# EAGLE design ignition3 (EAGLE 6.4)
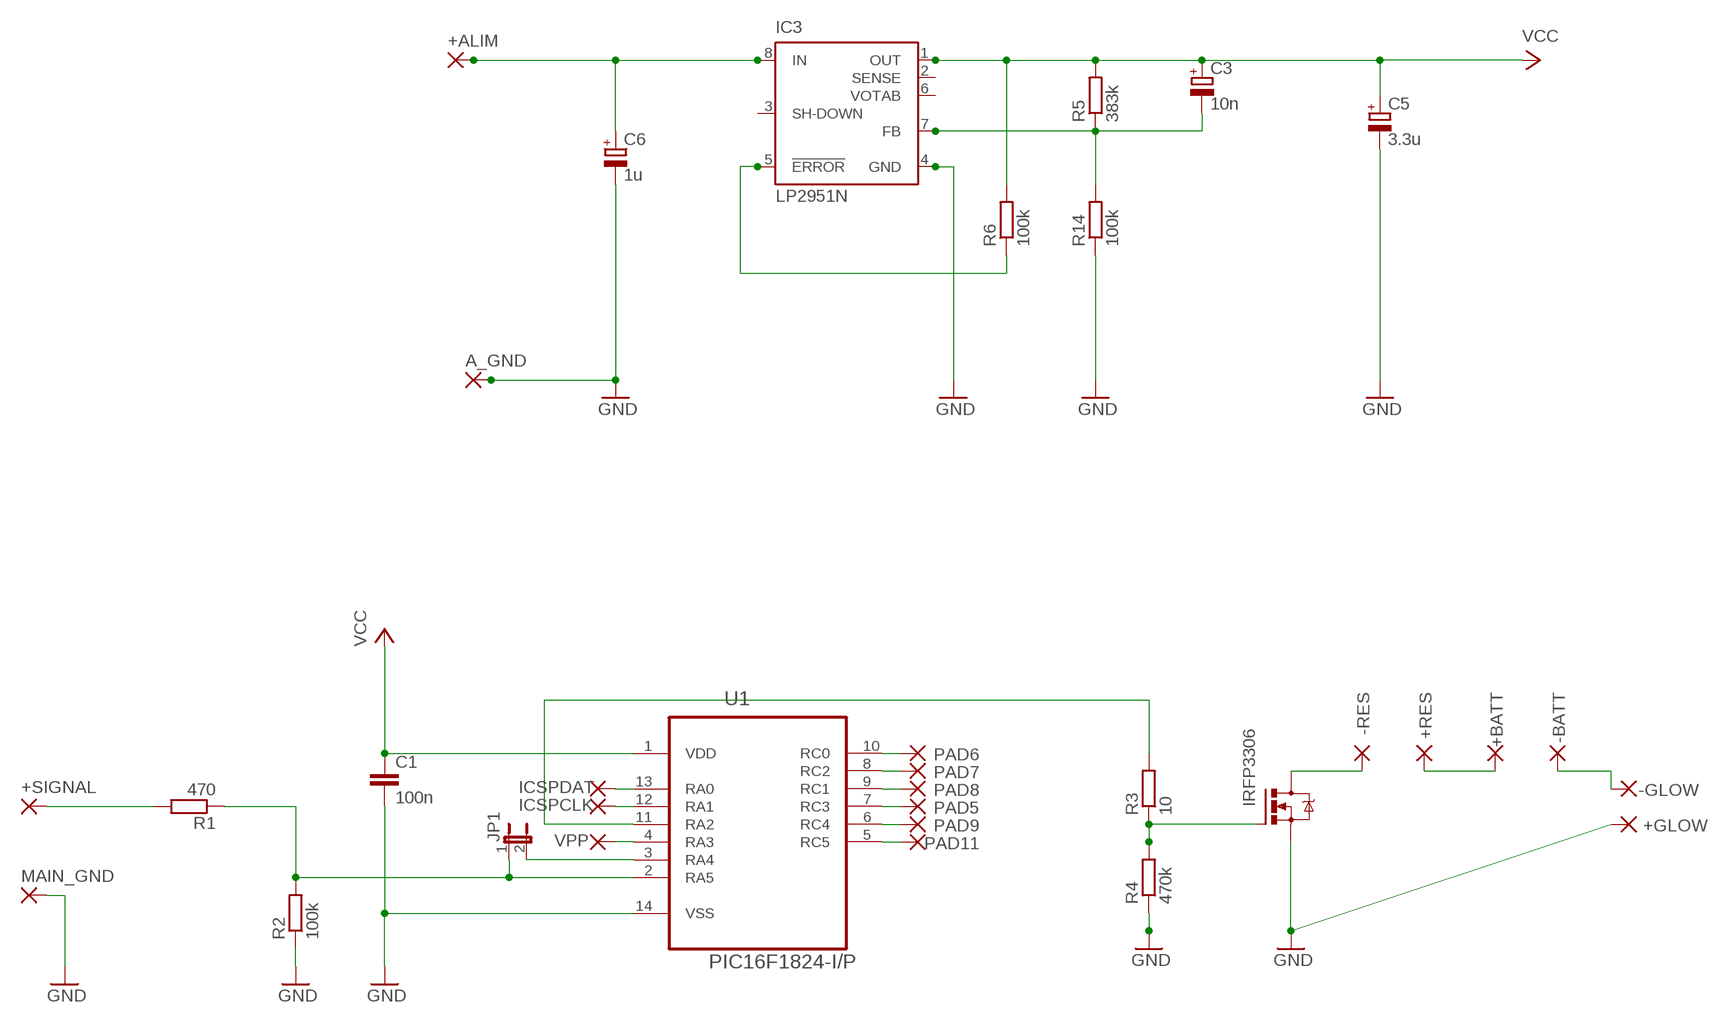
[diagram p0: schematic, sheet 1]

## Parts
+ALIM  2,15/1,0  [2,15/1,0]
+BATT  WIREPAD3,17/1,3  [3,17/1,3]
+GLOW  WIREPAD3,17/1,3  [3,17/1,3]
+RES  WIREPAD3,17/1,3  [3,17/1,3]
+SIGNAL  2,15/1,0  [2,15/1,0]
-BATT  WIREPAD3,17/1,3  [3,17/1,3]
-GLOW  WIREPAD3,17/1,3  [3,17/1,3]
-RES  WIREPAD3,17/1,3  [3,17/1,3]
A_GND  2,15/1,0  [2,15/1,0]
C1  100n  C-EU050-035X075  [C050-035X075]
C3  10n  CPOL-EUE5-6  [E5-6]
C5  3.3u  CPOL-EUE2.5-5  [E2,5-5]
C6  1u  CPOL-EUE2.5-5  [E2,5-5]
IC3  LP2951N  [DIL08]
ICSPCLK  2,15/1,0  [2,15/1,0]
ICSPDAT  2,15/1,0  [2,15/1,0]
JP1  JP1E  [JP1]
MAIN_GND  2,15/1,0  [2,15/1,0]
PAD5  2,15/1,0  [2,15/1,0]
PAD6  2,15/1,0  [2,15/1,0]
PAD7  2,15/1,0  [2,15/1,0]
PAD8  2,15/1,0  [2,15/1,0]
PAD9  2,15/1,0  [2,15/1,0]
PAD11  2,15/1,0  [2,15/1,0]
Q2  IRFP3306  IRFPC40  [TO247BV]
R1  470  R-EU_0207/7  [0207/7]
R2  100k  R-EU_0207/7  [0207/7]
R3  10  R-EU_0207/7  [0207/7]
R4  470k  R-EU_0207/7  [0207/7]
R5  383k  R-EU_0207/7  [0207/7]
R6  100k  R-EU_0207/7  [0207/7]
R14  100k  R-EU_0207/7  [0207/7]
U1  PIC16F1824-I/P  [DIP254P762X533-14]
VPP  2,15/1,0  [2,15/1,0]

## Nets
GND: +GLOW.1(P) A_GND.1(P) C1.2 C5.- C6.- IC3.4(GND) MAIN_GND.1(P) Q2.S R2.1 R4.1 R14.1 U1.14(VSS)
N$1: +SIGNAL.1(P) R1.2
N$2: JP1.1 R1.1 R2.2 U1.2(RA5)
N$3: R3.2 U1.11(RA2)
N$5: +ALIM.1(P) C6.+ IC3.8(IN)
N$6: Q2.G R3.1 R4.2
N$7: -RES.1(P) Q2.D
N$8: IC3.5(!ERROR) R6.1
N$9: JP1.2 U1.3(RA4)
N$10: +BATT.1(P) +RES.1(P)
N$11: -BATT.1(P) -GLOW.1(P)
N$12: U1.4(RA3) VPP.1(P)
N$13: C3.- IC3.7(FB) R5.1 R14.2
N$14: ICSPCLK.1(P) U1.12(RA1)
N$15: ICSPDAT.1(P) U1.13(RA0)
N$16: PAD6.1(P) U1.10(RC0)
N$17: PAD7.1(P) U1.8(RC2)
N$18: PAD8.1(P) U1.9(RC1)
N$19: PAD5.1(P) U1.7(RC3)
N$20: PAD9.1(P) U1.6(RC4)
N$21: PAD11.1(P) U1.5(RC5)
VCC: C1.1 C3.+ C5.+ IC3.1(OUT) R5.2 R6.2 U1.1(VDD)
Unconnected: IC3.2(SENSE) IC3.3(SH-DOWN) IC3.6(VOTAB)

## Library data of the parts
+ALIM +SIGNAL A_GND ICSPCLK ICSPDAT MAIN_GND PAD5-PAD9 PAD11 VPP = wirepad:2,15/1,0: THROUGH-HOLE PAD
+BATT +GLOW +RES -BATT -GLOW -RES = wirepad:WIREPAD: Wire PAD connect wire on PCB
C1 = rcl:C-EU: CAPACITOR, European symbol
C3 C5 C6 = rcl:CPOL-EU: POLARIZED CAPACITOR, European symbol
IC3 = linear:LP2951: 100 mA, Low Power Low Dropout Voltage Regulator Source: http://www.onsemi.com/pub/Collateral/LP2950-D.PDF
JP1 = jumper:JP1E: JUMPER
Q2 = transistor-power:IRFPC40: N-CHANNEL MOS FET
R1-R6 R14 = rcl:R-EU_: RESISTOR, European symbol
U1 = 16f1824dip:PIC16F1824-I/P: IC PIC MCU 8BIT 14KB FLSH,DIP-14; MPN: PIC16F1824-I/P; OC_FARNELL: 1814944; OC_NEWARK: 65R5964; PACKAGE: DIP-14; SUPPLIER: Microchip

## Net classes
0 default: width 1.27 mm, drill 0.508 mm, clearance 0.635 mm
1 power: width 2.54 mm, drill 0.508 mm, clearance 0.635 mm
2 bottom: clearance 1.27 mm

## Board
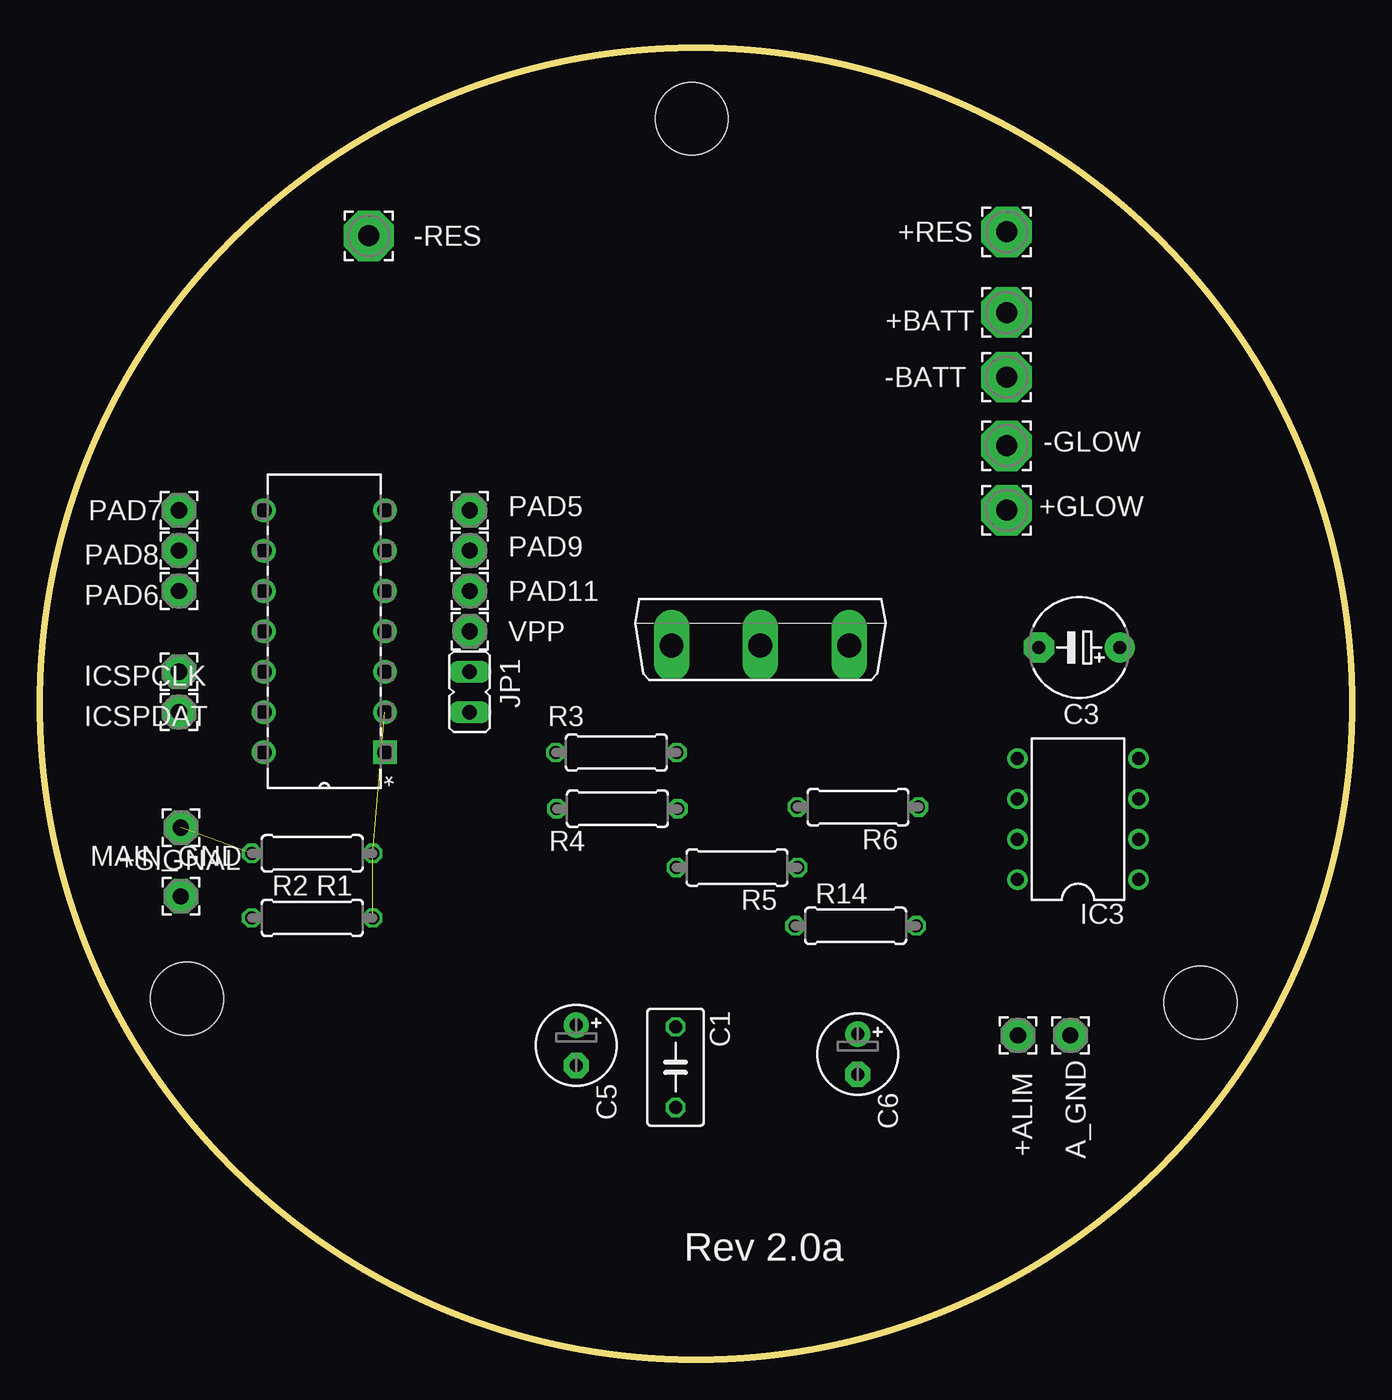
[diagram p1: board, top side]
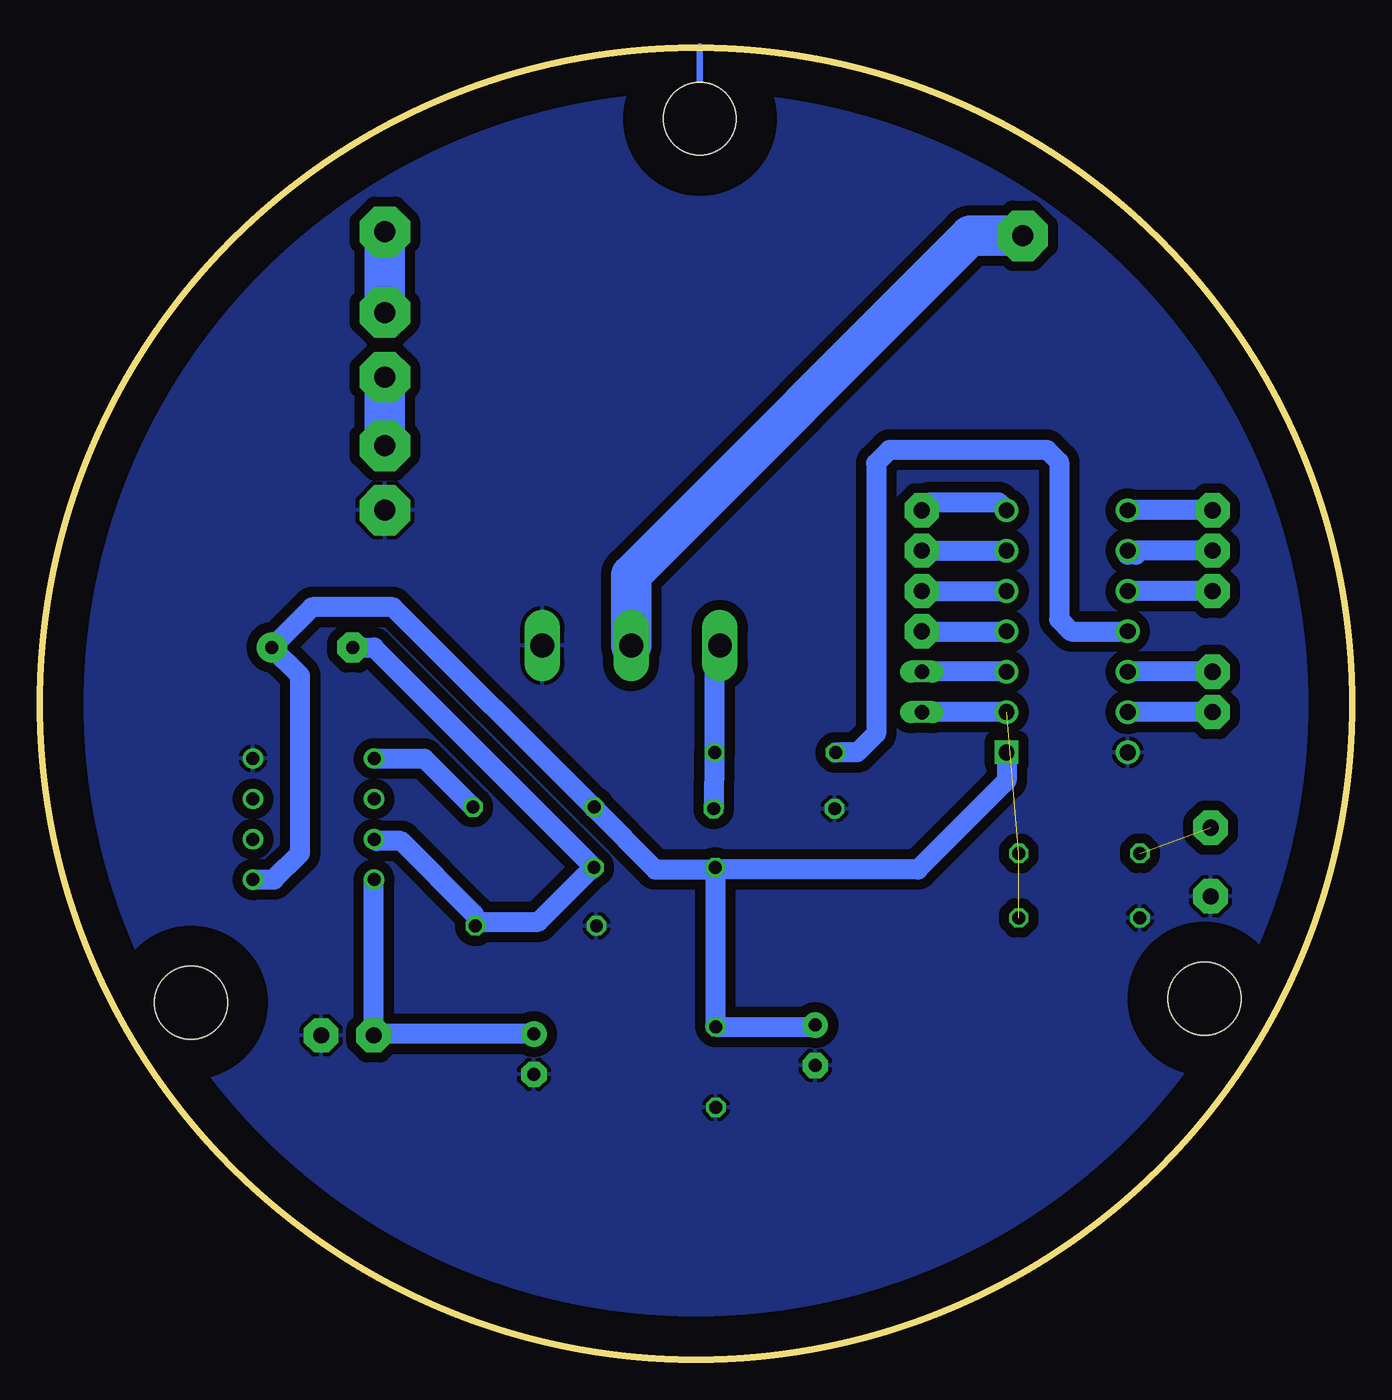
[diagram p2: board, bottom side, seen from below]

Size 82.55 x 82.55 mm. Coordinates in mm from the lower left corner, seen from the top.
Outline: circle at 41.27,41.27 radius 41.27
Copper layers (1*16): Top 0.035mm / dielectric 0.2mm / Bottom 0.035mm
Design rules "SeeedStudio_DRU_no_angle_20130527 *": minimum track width 6mil, minimum drill 12mil, track to track 6mil, track to pad 6mil, pad to pad 6mil, via to via 6mil, smd to smd 0mil, copper to edge 100mil, drill to drill 10mil, minimum pad ring 6mil, minimum via ring 6mil, stop-mask expansion 2mil, vias tented up to drill 25mil, thermal gap 10mil
Holes 4.57 mm at 41.02,78.11 9.27,22.73 73.03,22.48

### Footprints (pad centres in the part's own frame; a part is rotated, then mirrored left to right if it is on the bottom)
2,15/1,0 = drill 1.016 pad 2.159 octagon: 1 0,0
3,17/1,3 = drill 1.321 pad 3.175 octagon: 1 0,0
C050-035X075 = drill 0.813 octagon: 1 -2.54,0; 2 2.54,0
E5-6 = drill 0.813 pad 1.905: + -2.54,0 | drill 0.813 pad 1.905 octagon: - 2.54,0
E2,5-5 = drill 0.813 pad 1.6: + -1.27,0 | drill 0.813 pad 1.6 octagon: - 1.27,0
DIL08 = drill 0.813 pad 1.27: 1 -3.81,-3.81; 2 -1.27,-3.81; 3 1.27,-3.81; 4 3.81,-3.81; 5 3.81,3.81; 6 1.27,3.81; 7 -1.27,3.81; 8 -3.81,3.81
JP1 = drill 0.914 long: 1 0,-1.27; 2 0,1.27
TO247BV = drill 1.499 long: D 0,-2.921; G -5.588,-2.921; S 5.588,-2.921
0207/7 = drill 0.813 octagon: 1 -3.81,0; 2 3.81,0
DIP254P762X533-14 = drill 0.991 square: 1 -7.62,15.24 | drill 0.991: 2 -7.62,12.7; 3 -7.62,10.16; 4 -7.62,7.62; 5 -7.62,5.08; 6 -7.62,2.54; 7 -7.62,0; 8 0,0; 9 0,2.54; 10 0,5.08; 11 0,7.62; 12 0,10.16; 13 0,12.7; 14 0,15.24

### Placement (x,y rotation side)
+ALIM  61.54,20.42 0 top
+BATT  60.83,65.91 0 top
+GLOW  60.83,53.47 0 top
+RES  60.83,70.99 0 top
+SIGNAL  8.88,33.49 0 top
-BATT  60.83,61.85 0 top
-GLOW  60.83,57.53 0 top
-RES  20.7,70.74 0 top
A_GND  64.85,20.42 0 top
C1  40,18.41 270 top
C3  65.41,44.83 180 top
C5  33.76,19.79 270 top
C6  51.46,19.23 270 top
IC3  65.32,34.03 90 top
ICSPCLK  8.76,43.31 0 top
ICSPDAT  8.76,40.77 0 top
JP1  27.05,42.04 0 top
MAIN_GND  8.88,29.17 0 top
PAD5  27.05,53.47 0 top
PAD6  8.76,48.39 0 top
PAD7  8.76,53.47 0 top
PAD8  8.76,50.93 0 top
PAD9  27.05,50.93 0 top
PAD11  27.05,48.39 0 top
Q2  45.34,47.88 0 top
R1  17.14,31.88 180 top
R2  17.14,27.81 0 top
R3  36.28,38.22 180 top
R4  36.34,34.68 0 top
R5  43.87,30.98 180 top
R6  51.48,34.78 180 top
R14  51.33,27.31 0 top
U1  14.1,53.47 180 top
VPP  27.05,45.85 0 top

### Tracks (layer width: path | path; a pad name or v marks a point on that pad's centre or on a via)
GND
  pour Bottom: -4.45,83.19 83.44,83.19 83.44,-0.64 -4.45,-0.64
N$1  (1 unrouted)
N$2  (2 unrouted)
  Bottom 1.27: U1.2 JP1.1
N$3
  Bottom 1.27: U1.11 17.65,45.85 18.41,46.61 18.41,56.52 19.18,57.28 29.08,57.28 29.93,56.43 29.93,39.41 31.11,38.23 R3.2
N$4
  Bottom 0.406: 41.02,78.11 41.02,82.68
N$5
  Bottom 1.27: C6.+ 61.46,20.5 +ALIM.1 61.54,30.19 IC3.8
N$6
  Bottom 1.27: R4.2 40.1,38.22 R3.1 40.09,44.62 Q2.G
N$7
  Bottom 2.54: -RES.1 24,70.74 45.34,49.4 Q2.D
N$8
  Bottom 1.27: IC3.5 58.35,37.84 R6.1
N$9
  Bottom 1.27: U1.3 JP1.2
N$10
  Bottom 2.54: +RES.1 +BATT.1
N$11
  Bottom 2.54: -BATT.1 -GLOW.1
N$12
  Bottom 1.27: VPP.1 U1.4
N$13
  Bottom 1.27: 54.99,27.56 51.18,27.56 47.88,30.86 R5.1 61.53,44.83 C3.- | 54.99,27.56 R14.2 | IC3.7 61.34,32.64 59.82,32.64 55.24,28.07 54.99,27.56
N$14
  Bottom 1.27: ICSPCLK.1 U1.12
N$15
  Bottom 1.27: ICSPDAT.1 U1.13
N$16
  Bottom 1.27: PAD6.1 U1.10
N$17
  Bottom 1.27: PAD7.1 U1.8
N$18
  Bottom 1.27: PAD8.1 13.59,50.93 13.59,50.67 14.1,50.67 U1.9
N$19
  Bottom 1.27: U1.7 22.22,53.98 26.54,53.98 PAD5.1
N$20
  Bottom 1.27: PAD9.1 U1.6
N$21
  Bottom 1.27: PAD11.1 U1.5
VCC
  Bottom 1.27: R6.2 47.67,34.72 | 47.67,34.72 43.81,30.86 40.18,30.86 R5.2 | R5.2 40.06,21.01 C1.1 33.87,20.95 C5.+ | U1.1 21.72,36.45 27.3,30.86 39.94,30.86 R5.2 | 47.67,34.72 60.32,47.37 65.41,47.37 C3.+ 66.17,43.05 66.17,31.88 67.82,30.22 IC3.1

### Text on the board
tPlace: Rev 2.0a